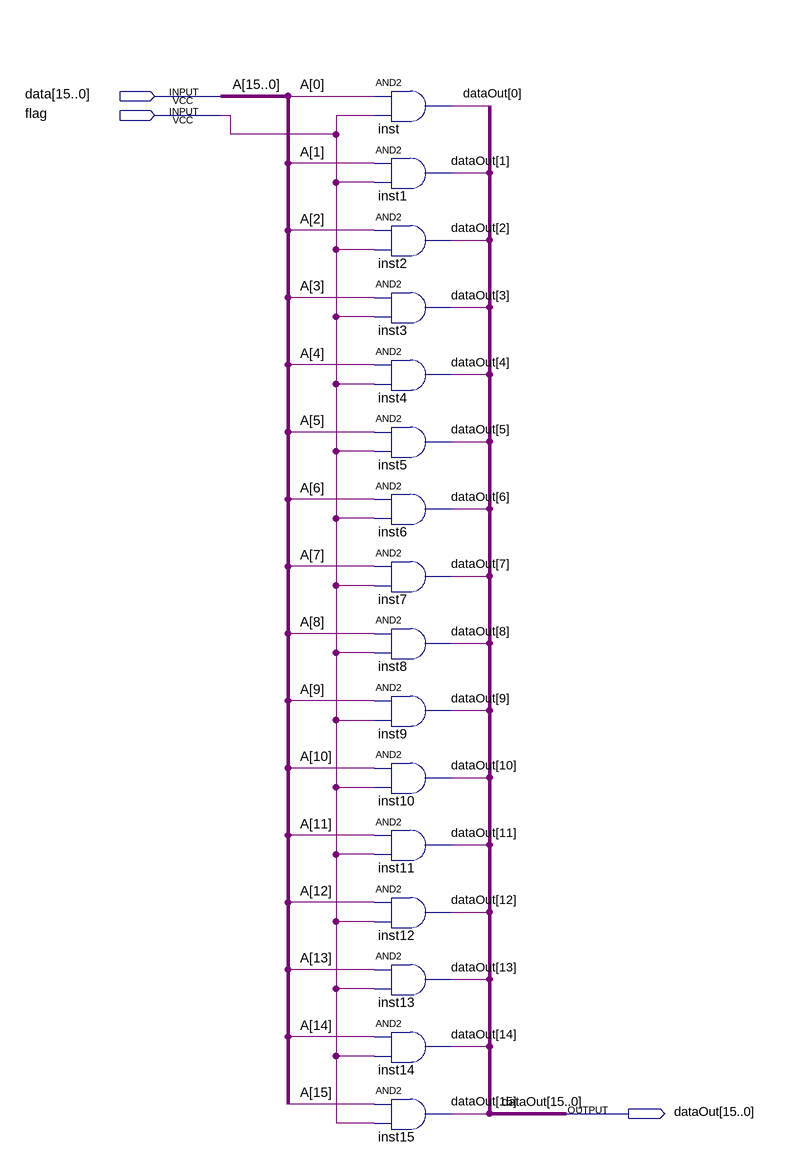
[diagram p0: schematic sheet]
// Quartus schematic dataselect.bdf as structural Verilog: 16 symbols, 3 pins
module dataselect (
  input  [15:0] data,
  input  flag,
  output [15:0] dataOut
);

  and inst (dataOut[0], data[0], flag);
  and inst1 (dataOut[1], data[1], flag);
  and inst2 (dataOut[2], data[2], flag);
  and inst3 (dataOut[3], data[3], flag);
  and inst4 (dataOut[4], data[4], flag);
  and inst5 (dataOut[5], data[5], flag);
  and inst6 (dataOut[6], data[6], flag);
  and inst7 (dataOut[7], data[7], flag);
  and inst8 (dataOut[8], data[8], flag);
  and inst9 (dataOut[9], data[9], flag);
  and inst10 (dataOut[10], data[10], flag);
  and inst11 (dataOut[11], data[11], flag);
  and inst12 (dataOut[12], data[12], flag);
  and inst13 (dataOut[13], data[13], flag);
  and inst14 (dataOut[14], data[14], flag);
  and inst15 (dataOut[15], data[15], flag);

  // Other names for the same wires on the sheet: A[15:0] = data
endmodule
